# Altium schematic sheet Voltage Regulation.SchDoc
size A4; SheetNumber: 2; SheetTotal: 2
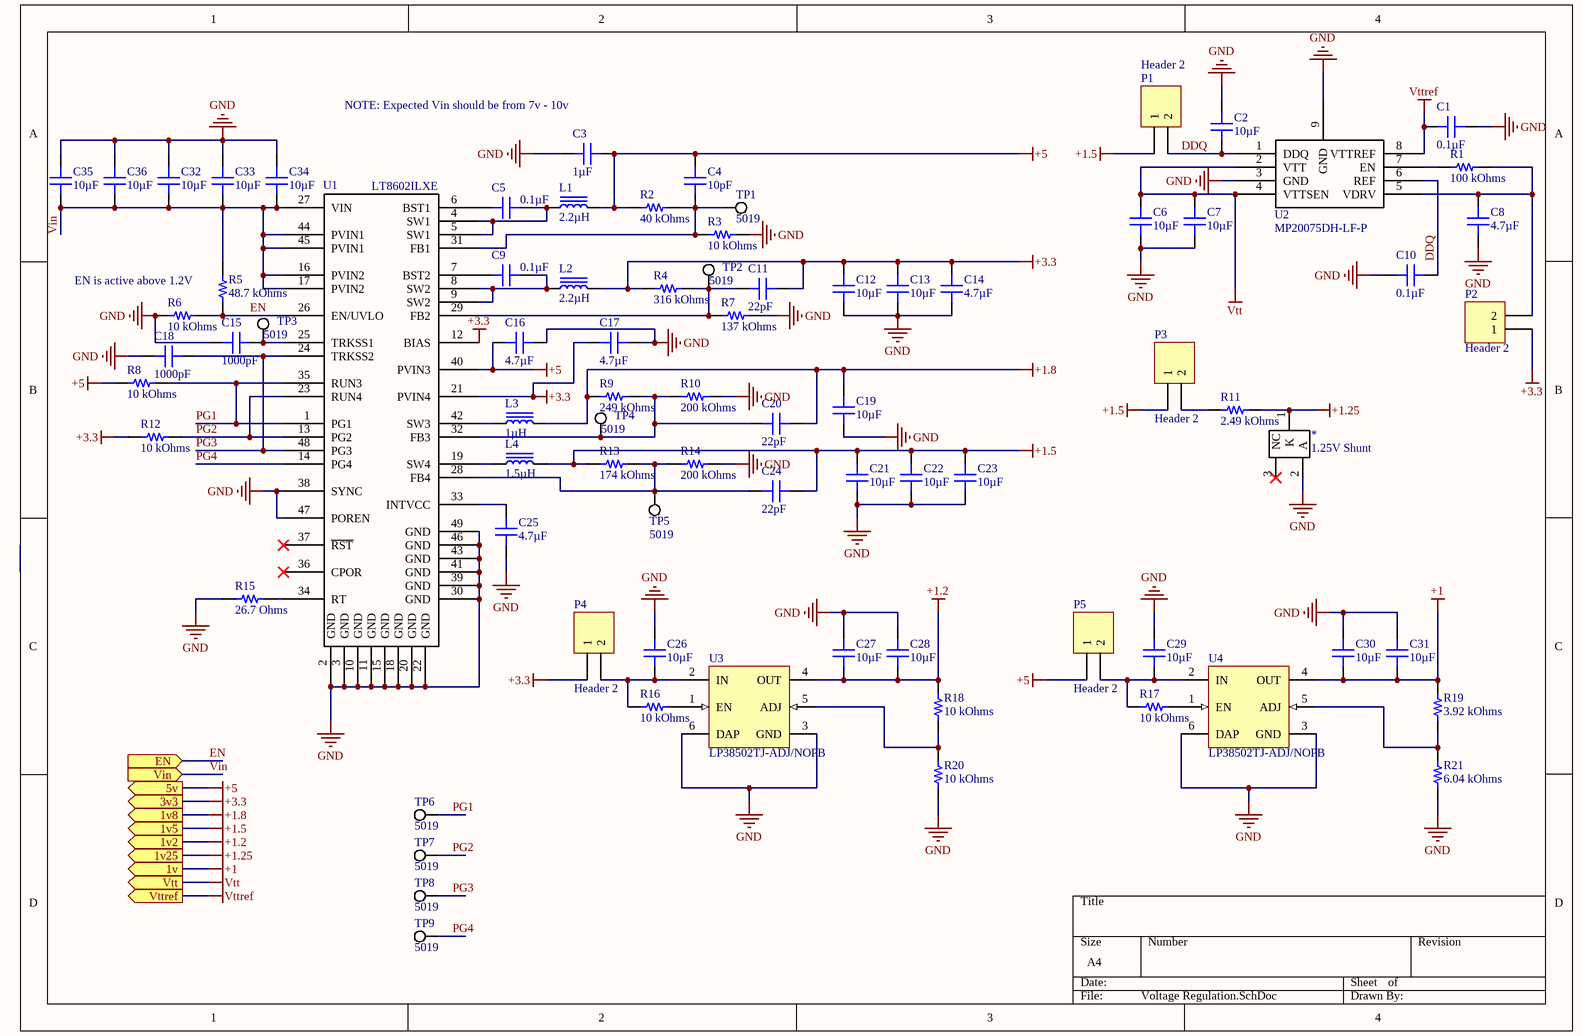
[diagram p0: Voltage Regulation.SchDoc]

## Parts
*  1.25V Shunt  [TS4061AILT-1.25]
C1  0.1µF  [CAP 0805_2012]
C2  10µF  [CAP 0805_2012]
C3  1µF  [CAP 0805_2012]
C4  10pF  [CAP 0805_2012]
C5  0.1µF  [CAP 0805_2012]
C6  10µF  [CAP 0805_2012]
C7  10µF  [CAP 0805_2012]
C8  4.7µF  [CAP 0805_2012]
C9  0.1µF  [CAP 0805_2012]
C10  0.1µF  [CAP 0805_2012]
C11  22pF  [CAP 0805_2012]
C12  10µF  [CAP 0805_2012]
C13  10µF  [CAP 0805_2012]
C14  4.7µF  [CAP 0805_2012]
C15  1000pF  [CAP 0805_2012]
C16  4.7µF  [CAP 0805_2012]
C17  4.7µF  [CAP 0805_2012]
C18  1000pF  [CAP 0805_2012]
C19  10µF  [CAP 0805_2012]
C20  22pF  [CAP 0805_2012]
C21  10µF  [CAP 0805_2012]
C22  10µF  [CAP 0805_2012]
C23  10µF  [CAP 0805_2012]
C24  22pF  [CAP 0805_2012]
C25  4.7µF  [CAP 0805_2012]
C26  10µF  [CAP 0805_2012]
C27  10µF  [CAP 0805_2012]
C28  10µF  [CAP 0805_2012]
C29  10µF  [CAP 0805_2012]
C30  10µF  [CAP 0805_2012]
C31  10µF  [CAP 0805_2012]
C32  10µF  [CAP 0805_2012]
C33  10µF  [CAP 0805_2012]
C34  10µF  [CAP 0805_2012]
C35  10µF  [CAP 0805_2012]
C36  10µF  [CAP 0805_2012]
L1  2.2µH  [WURTH WE-LQS 6045]
L2  2.2µH  [WURTH WE-LQS 6045]
L3  1µH  [IND 0806_2016]
L4  1.5µH  [TDK VLS252012HBX-1]
P1  Header 2  [HDR1X2]
P2  Header 2  [HDR1X2]
P3  Header 2  [HDR1X2]
P4  Header 2  [HDR1X2]
P5  Header 2  [HDR1X2]
R1  100 kOhms  [RES 0805_2012]
R2  40 kOhms  [RES 0805_2012]
R3  10 kOhms  [RES 0805_2012]
R4  316 kOhms  [RES 0805_2012]
R5  48.7 kOhms  [RES 0805_2012]
R6  10 kOhms  [RES 0805_2012]
R7  137 kOhms  [RES 0805_2012]
R8  10 kOhms  [RES 0805_2012]
R9  249 kOhms  [RES 0805_2012]
R10  200 kOhms  [RES 0805_2012]
R11  2.49 kOhms  [RES 0805_2012]
R12  10 kOhms  [RES 0805_2012]
R13  174 kOhms  [RES 0805_2012]
R14  200 kOhms  [RES 0805_2012]
R15  26.7 Ohms  [RES 0805_2012]
R16  10 kOhms  [RES 0805_2012]
R17  10 kOhms  [RES 0805_2012]
R18  10 kOhms  [RES 0805_2012]
R19  3.92 kOhms  [RES 0805_2012]
R20  10 kOhms  [RES 0805_2012]
R21  6.04 kOhms  [RES 0805_2012]
TP1  5019  [KSTN-5019_V]
TP2  5019  [KSTN-5019_V]
TP3  5019  [KSTN-5019_V]
TP4  5019  [KSTN-5019_V]
TP5  5019  [KSTN-5019_V]
TP6  5019  [KSTN-5019_V]
TP7  5019  [KSTN-5019_V]
TP8  5019  [KSTN-5019_V]
TP9  5019  [KSTN-5019_V]
U1  LT8602ILXE  [Quad48]
U2  MP20075DH-LF-P  [MP20075]
U3  LP38502TJ-ADJ/NOPB  [NDQ0005A_L]
U4  LP38502TJ-ADJ/NOPB  [NDQ0005A_L]

## Ports
1v2 (out), 1v5 (out), 1v8 (out), 1v25 (out), 1v (out), 3v3 (out), 5v (out), EN (in), Vin (in), Vtt (out), Vttref (out)

## Nets
+1: C30.1 C31.1 R19.2 U4.4(OUT) ; port 1v
+1.2: C27.1 C28.1 R18.2 U3.4(OUT) ; port 1v2
+1.5: C21.2 C22.2 C23.2 C24.2 L4.2 P1.1 P3.1 R13.1 ; port 1v5
+1.8: C19.2 C20.2 L3.2 R9.1 ; port 1v8
+1.25: *.1(K) R11.2 ; port 1v25
+3.3: C11.2 C12.2 C13.2 C14.2 C17.2 L2.2 P2.1 P4.1 R4.1 R12.1 U1.12(BIAS) U1.21(PVIN4) ; port 3v3
+5: C3.2 C4.2 C16.2 L1.2 P5.1 R2.1 R8.1 U1.40(PVIN3) ; port 5v
GND: *.2(A) C1.2 C2.2 C3.1 C6.1 C7.1 C8.1 C10.1 C12.1 C13.1 C14.1 C15.1 C16.1 C17.1 C18.1 C19.1 C21.1 C22.1 C23.1 C25.1 C26.2 C27.2 C28.2 C29.2 C30.2 C31.2 C32.2 C33.2 C34.2 C35.2 C36.2 R3.2 R6.1 R7.2 R10.2 R14.2 R15.1 R20.1 R21.1 U1.2(GND) U1.3(GND) U1.10(GND) U1.11(GND) U1.15(GND) U1.18(GND) U1.20(GND) U1.22(GND) U1.30(GND) U1.38(SYNC) U1.39(GND) U1.41(GND) U1.43(GND) U1.46(GND) U1.47(POREN) U1.49(GND) U2.3(GND) U2.9(GND) U3.3(GND) U3.6(DAP) U4.3(GND) U4.6(DAP)
Vtt: C6.2 C7.2 U2.2(VTT) U2.4(VTTSEN) ; port Vtt
Vttref: C1.1 U2.8(VTTREF) ; port Vttref
DDQ: C2.1 C10.2 P1.2 U2.1(DDQ) U2.6(REF)
EN: R5.1 R6.2 U1.26(EN/UVLO) ; port EN
PG1: R8.2 TP6.1 U1.1(PG1) U1.35(RUN3)
PG2: R12.2 TP7.1 U1.13(PG2) U1.23(RUN4)
PG3: C18.2 TP8.1 U1.24(TRKSS2) U1.48(PG3)
PG4: TP9.1 U1.14(PG4)
Vin: C32.1 C33.1 C34.1 C35.1 C36.1 R5.2 U1.16(PVIN2) U1.17(PVIN2) U1.27(VIN) U1.44(PVIN1) U1.45(PVIN1) ; port Vin
NetC4_1: C4.1 R2.2 R3.1 TP1.1 U1.31(FB1)
NetC5_1: C5.1 U1.6(BST1)
NetC5_2: C5.2 L1.1 U1.4(SW1) U1.5(SW1)
NetC8_2: C8.2 P2.2 R1.1 U2.5(VDRV)
NetC9_1: C9.1 U1.7(BST2)
NetC9_2: C9.2 L2.1 U1.8(SW2) U1.9(SW2)
NetC11_1: C11.1 R4.2 R7.1 TP2.1 U1.29(FB2)
NetC15_2: C15.2 TP3.1 U1.25(TRKSS1)
NetC20_1: C20.1 R9.2 R10.1 TP4.1 U1.32(FB3)
NetC24_1: C24.1 R13.2 R14.1 TP5.1 U1.28(FB4)
NetC25_2: C25.2 U1.33(INTVCC)
NetC26_1: C26.1 P4.2 R16.1 U3.2(IN)
NetC29_1: C29.1 P5.2 R17.1 U4.2(IN)
NetL3_1: L3.1 U1.42(SW3)
NetL4_1: L4.1 U1.19(SW4)
NetP3_2: P3.2 R11.1
NetR1_2: R1.2 U2.7(EN)
NetR15_2: R15.2 U1.34(RT)
NetR16_2: R16.2 U3.1(EN)
NetR17_2: R17.2 U4.1(EN)
NetR18_1: R18.1 R20.2 U3.5(ADJ)
NetR19_1: R19.1 R21.2 U4.5(ADJ)

Not connected (* = marked no-connect by the designer): * 3(NC)*; U1 36(CPOR)* 37(~{RST})*

## Notes on the sheet
- (near C3) NOTE: Expected Vin should be from 7v - 10v
- (near R5) EN is active above 1.2V

## Library data of the parts
C1 C10 = 08055C104KAT4A: CAP CER 0.1UF 50V X7R 0805; Manufacturer: AVX Corporation; Tolerance: ±10%; Part Number: 08055C104KAT4A; Value: 0.1µF; Applications: General Purpose; Capacitance: 0.1µF; ComponentLink1Description: Datasheet; ComponentLink1URL: http://datasheets.avx.com/X7RDielectric.pdf; ComponentLink2Description: DigiKey Link; ComponentLink2URL: http://digikey.com/product-detail/en/avx-corporation/08055C104KAT4A/478-10836-1-ND/7536355; Device Package: 0805 (2012 Metric); LastUpdated: 2020-09-02 1:04:35 AM; Lifecycle Status: Active; Minimum Order: 1; Mounting Type: Surface Mount, MLCC; Operating Temperature: -55°C ~ 125°C; Package / Case: 0805 (2012 Metric); Packaging: TapeAndReel; PartId: 6258; Part Status: Active; Price: 0.01; Series: -; Size / Dimension: 0.079" L x 0.049" W (2.01mm x 1.25mm); Supplier 1: DigiKey; Supplier Part Number 1: 478-10836-1-ND; Temperature Coefficient: X7R; Thickness (Max): 0.037" (0.94mm); Voltage - Rated: 50V
C2 C6 C7 C12 C13 C19 C21-C23 C26-C36 = CL21B106KQQNFNE: CAP CER 10UF 6.3V X7R 0805; Manufacturer: Samsung Electro-Mechanics; Tolerance: ±10%; Part Number: CL21B106KQQNFNE; Value: 10µF; Applications: General Purpose; Capacitance: 10µF; ComponentLink1Description: Datasheet; ComponentLink1URL: http://www.samsungsem.com/kr/support/product-search/mlcc/CL21B106KQQNFNE.jsp; ComponentLink2Description: DigiKey Link; ComponentLink2URL: http://digikey.com/product-detail/en/samsung-electro-mechanics/CL21B106KQQNFNE/1276-2935-1-ND/3891021; Device Package: 0805 (2012 Metric); LastUpdated: 2020-09-02 1:04:08 AM; Lifecycle Status: Active; Minimum Order: 1; Mounting Type: Surface Mount, MLCC; Operating Temperature: -55°C ~ 125°C; Package / Case: 0805 (2012 Metric); Packaging: TapeAndReel; PartId: 17977; Part Status: Active; Price: 0.05; Series: CL; Size / Dimension: 0.079" L x 0.049" W (2.00mm x 1.25mm); Supplier 1: DigiKey; Supplier Part Number 1: 1276-2935-1-ND; Temperature Coefficient: X7R; Thickness (Max): 0.055" (1.40mm); Voltage - Rated: 6.3V
C3 = 885012207078: CAP CER 1UF 25V X7R 0805; Manufacturer: Würth Elektronik; Tolerance: ±10%; Part Number: 885012207078; Value: 1µF; Applications: General Purpose; Capacitance: 1µF; ComponentLink1Description: Datasheet; ComponentLink1URL: https://katalog.we-online.de/pbs/datasheet/885012207078.pdf; ComponentLink2Description: DigiKey Link; ComponentLink2URL: http://digikey.com/product-detail/en/w-rth-elektronik/885012207078/732-7672-1-ND/5454299; Device Package: 0805 (2012 Metric); LastUpdated: 2020-09-02 1:04:13 AM; Lifecycle Status: Active; Minimum Order: 1; Mounting Type: Surface Mount, MLCC; Operating Temperature: -55°C ~ 125°C; Package / Case: 0805 (2012 Metric); Packaging: TapeAndReel; PartId: 16212; Part Status: Active; Price: 0.06; Series: WCAP-CSGP; Size / Dimension: 0.079" L x 0.049" W (2.00mm x 1.25mm); Supplier 1: DigiKey; Supplier Part Number 1: 732-7672-1-ND; Temperature Coefficient: X7R; Thickness (Max): 0.053" (1.35mm); Voltage - Rated: 25V
C4 = C0805C100K5GACTU: CAP CER 10PF 50V C0G/NP0 0805; Manufacturer: KEMET; Temperature Coefficient: C0G, NP0; Tolerance: ±10%; Part Number: C0805C100K5GACTU; Value: 10pF; Applications: General Purpose; Capacitance: 10pF; ComponentLink1Description: Datasheet; ComponentLink1URL: https://api.kemet.com/component-edge/download/datasheet/C0805C100K5GACTU.pdf; ComponentLink2Description: DigiKey Link; ComponentLink2URL: http://digikey.com/product-detail/en/kemet/C0805C100K5GACTU/399-7975-1-ND/3471698; Device Package: 0805 (2012 Metric); Features: Low ESL; LastUpdated: 2020-09-02 1:04:20 AM; Lifecycle Status: Active; Minimum Order: 1; Mounting Type: Surface Mount, MLCC; Operating Temperature: -55°C ~ 125°C; Package / Case: 0805 (2012 Metric); Packaging: TapeAndReel; PartId: 14017; Part Status: Active; Price: 0.01; Series: SMD Comm C0G; Size / Dimension: 0.079" L x 0.049" W (2.00mm x 1.25mm); Supplier 1: DigiKey; Supplier Part Number 1: 399-7975-1-ND; Thickness (Max): 0.035" (0.88mm); Voltage - Rated: 50V
C5 C9 = C0805C104M5RACTU: CAP CER 0.1UF 50V X7R 0805; Manufacturer: KEMET; Tolerance: ±20%; Part Number: C0805C104M5RACTU; Value: 0.1µF; Applications: Bypass, Decoupling; Capacitance: 0.1µF; ComponentLink1Description: Datasheet; ComponentLink1URL: https://api.kemet.com/component-edge/download/datasheet/C0805C104M5RACTU.pdf; ComponentLink2Description: DigiKey Link; ComponentLink2URL: http://digikey.com/product-detail/en/kemet/C0805C104M5RACTU/399-1169-1-ND/411444; Device Package: 0805 (2012 Metric); LastUpdated: 2020-09-02 1:04:36 AM; Lifecycle Status: Active; Minimum Order: 1; Mounting Type: Surface Mount, MLCC; Operating Temperature: -55°C ~ 125°C; Package / Case: 0805 (2012 Metric); Packaging: TapeAndReel; PartId: 5793; Part Status: Active; Price: 0.01; Series: SMD Comm X7R; Size / Dimension: 0.079" L x 0.049" W (2.00mm x 1.25mm); Supplier 1: DigiKey; Supplier Part Number 1: 399-1169-1-ND; Temperature Coefficient: X7R; Thickness (Max): 0.035" (0.88mm); Voltage - Rated: 50V
C8 C14 C16 C17 C25 = GRM21BR71C475KE51L: CAP CER 4.7UF 16V X7R 0805; Manufacturer: Murata Electronics; Tolerance: ±10%; Part Number: GRM21BR71C475KE51L; Value: 4.7µF; Applications: General Purpose; Capacitance: 4.7µF; ComponentLink1Description: Datasheet; ComponentLink1URL: https://search.murata.co.jp/Ceramy/image/img/A01X/G101/ENG/GRM21BR71C475KE51-01.pdf; ComponentLink2Description: DigiKey Link; ComponentLink2URL: http://digikey.com/product-detail/en/murata-electronics/GRM21BR71C475KE51L/490-14466-1-ND/6606927; Device Package: 0805 (2012 Metric); LastUpdated: 2020-09-02 1:04:31 AM; Lifecycle Status: Active; Minimum Order: 1; Mounting Type: Surface Mount, MLCC; Operating Temperature: -55°C ~ 125°C; Package / Case: 0805 (2012 Metric); Packaging: TapeAndReel; PartId: 8696; Part Status: Active; Price: 0.04; Series: GRM; Size / Dimension: 0.079" L x 0.049" W (2.00mm x 1.25mm); Supplier 1: DigiKey; Supplier Part Number 1: 490-14466-1-ND; Temperature Coefficient: X7R; Thickness (Max): 0.055" (1.40mm); Voltage - Rated: 16V
C11 C20 C24 = C0805C220J5RAC7800: CAP CER SMD 0805 22PF 5% 50V X7R; Manufacturer: KEMET; Part Number: C0805C220J5RAC7800; Value: 22pF; Applications: Bypass, Decoupling; Capacitance: 22pF; ComponentLink1Description: Datasheet; ComponentLink1URL: https://api.kemet.com/component-edge/download/datasheet/C0805C220J5RAC7800.pdf; ComponentLink2Description: DigiKey Link; ComponentLink2URL: http://digikey.com/product-detail/en/kemet/C0805C220J5RAC7800/399-17625-1-ND/8572625; Device Package: 0805 (2012 Metric); LastUpdated: 2020-09-02 1:04:09 AM; Lifecycle Status: Active; Minimum Order: 1; Mounting Type: Surface Mount, MLCC; Operating Temperature: -55°C ~ 125°C; Package / Case: 0805 (2012 Metric); Packaging: TapeAndReel; PartId: 17442; Part Status: Active; Price: 0.03; Series: SMD Comm X7R; Size / Dimension: 0.079" L x 0.049" W (2.00mm x 1.25mm); Supplier 1: DigiKey; Supplier Part Number 1: 399-17625-1-ND; Temperature Coefficient: X7R; Thickness (Max): 0.035" (0.88mm); Tolerance: ±5%; Voltage - Rated: 50V
C15 C18 = 885012207033: CAP CER 1000PF 16V X7R 0805; Manufacturer: Würth Elektronik; Tolerance: ±10%; Part Number: 885012207033; Value: 1000pF; Applications: General Purpose; Capacitance: 1000pF; ComponentLink1Description: Datasheet; ComponentLink1URL: https://katalog.we-online.de/pbs/datasheet/885012207033.pdf; ComponentLink2Description: DigiKey Link; ComponentLink2URL: http://digikey.com/product-detail/en/w-rth-elektronik/885012207033/732-8033-1-ND/5454660; Device Package: 0805 (2012 Metric); LastUpdated: 2020-09-02 1:04:24 AM; Lifecycle Status: Active; Minimum Order: 1; Mounting Type: Surface Mount, MLCC; Operating Temperature: -55°C ~ 125°C; Package / Case: 0805 (2012 Metric); Packaging: TapeAndReel; PartId: 12259; Part Status: Active; Price: 0.03; Series: WCAP-CSGP; Size / Dimension: 0.079" L x 0.049" W (2.00mm x 1.25mm); Supplier 1: DigiKey; Supplier Part Number 1: 732-8033-1-ND; Temperature Coefficient: X7R; Thickness (Max): 0.035" (0.90mm); Voltage - Rated: 16V
L1 L2 = 74404064022: FIXED IND 2.2UH 4.6A 14 MOHM SMD; Manufacturer: Würth Elektronik; Current - Saturation: 7.4A; DC Resistance (DCR): 14mOhm; Frequency - Self Resonant: 60MHz; Inductance Frequency - Test: 100kHz; Material - Core: Ferrite; Shielding: Shielded; Tolerance: ±30%; Type: Wirewound; Part Number: 74404064022; ComponentLink1Description: Datasheet; ComponentLink1URL: https://katalog.we-online.de/pbs/datasheet/74404064022.pdf; ComponentLink2Description: DigiKey Link; ComponentLink2URL: http://digikey.com/product-detail/en/w-rth-elektronik/74404064022/732-5544-1-ND/4865437; Current Rating (Amps): 4.6A; Device Package: Nonstandard; Height - Seated (Max): 0.177" (4.50mm); Inductance: 2.2µH; LastUpdated: 2020-08-13 11:04:46 AM; Lifecycle Status: Active; Minimum Order: 1; Mounting Type: Surface Mount; Operating Temperature: -40°C ~ 125°C; Package / Case: Nonstandard; Packaging: TapeAndReel; PartId: 3699; Part Status: Active; Price: 0.69; Series: WE-LQS; Size / Dimension: 0.236" L x 0.236" W (6.00mm x 6.00mm); Supplier 1: DigiKey; Supplier Part Number 1: 732-5544-1-ND; Supplier Device Package: 6045; Value: 2.2µH
L3 = VLS201612HBX-1R0M-1: FIXED IND 1UH 2.7A 72 MOHM SMD; Manufacturer: TDK Corporation; Current - Saturation: 2.42A; DC Resistance (DCR): 72mOhm Max; Inductance Frequency - Test: 1MHz; Material - Core: Metal; Shielding: Shielded; Tolerance: ±20%; Type: Wirewound; Part Number: VLS201612HBX-1R0M-1; ComponentLink1Description: Datasheet; ComponentLink1URL: https://product.tdk.com/info/en/catalog/datasheets/inductor_commercial_power_vls201612hbx-1_en.pdf?ref_disty=digikey; ComponentLink2Description: DigiKey Link; ComponentLink2URL: http://digikey.com/product-detail/en/tdk-corporation/VLS201612HBX-1R0M-1/445-173010-1-ND/5250929; Current Rating (Amps): 2.7A; Device Package: 0806 (2016 Metric); Height - Seated (Max): 0.047" (1.20mm); Inductance: 1µH; LastUpdated: 2020-09-02 1:24:35 AM; Lifecycle Status: Active; Minimum Order: 1; Mounting Type: Surface Mount; Operating Temperature: -40°C ~ 105°C; Package / Case: 0806 (2016 Metric); Packaging: TapeAndReel; PartId: 225; Part Status: Active; Price: 0.13; Series: VLS-HBX-1; Size / Dimension: 0.079" L x 0.063" W (2.00mm x 1.60mm); Supplier 1: DigiKey; Supplier Part Number 1: 445-173010-1-ND; Supplier Device Package: 0806 (2016 Metric); Value: 1µH
L4 = VLS252012HBX-1R5M-1: FIXED IND 1.5UH 2.75A 82 MOHM; Manufacturer: TDK Corporation; Current - Saturation: 2.5A; DC Resistance (DCR): 82mOhm Max; Inductance Frequency - Test: 1MHz; Material - Core: Metal; Shielding: Shielded; Tolerance: ±20%; Type: Wirewound; Part Number: VLS252012HBX-1R5M-1; ComponentLink1Description: Datasheet; ComponentLink1URL: https://product.tdk.com/info/en/catalog/datasheets/inductor_commercial_power_vls252012hbx-1_en.pdf?ref_disty=digikey; ComponentLink2Description: DigiKey Link; ComponentLink2URL: http://digikey.com/product-detail/en/tdk-corporation/VLS252012HBX-1R5M-1/445-173026-1-ND/5250945; Current Rating (Amps): 2.75A; Device Package: 1008 (2520 Metric); Height - Seated (Max): 0.047" (1.20mm); Inductance: 1.5µH; LastUpdated: 2020-09-02 1:22:18 AM; Lifecycle Status: Active; Minimum Order: 1; Mounting Type: Surface Mount; Operating Temperature: -40°C ~ 105°C; Package / Case: 1008 (2520 Metric); Packaging: TapeAndReel; PartId: 239; Part Status: Active; Price: 0.14; Series: VLS-HBX-1; Size / Dimension: 0.098" L x 0.079" W (2.50mm x 2.00mm); Supplier 1: DigiKey; Supplier Part Number 1: 445-173026-1-ND; Supplier Device Package: 1008 (2520 Metric); Value: 1.5µH
P1-P5 = Header 2: Header, 2-Pin; LatestRevisionDate: 17-Jul-2002; LatestRevisionNote: Re-released for DXP Platform.; Publisher: Altium Limited
R1 = CR0805-FX-1003ELF: RES SMD 100K OHM 1% 1/8W 0805; Manufacturer: Bourns Inc.; Power (Watts): 0.125W, 1/8W; Temperature Coefficient: ±100ppm/°C; Part Number: CR0805-FX-1003ELF; Value: 100 kOhms; ComponentLink1Description: Datasheet; ComponentLink1URL: https://www.bourns.com/docs/Product-Datasheets/CHPREZTR.pdf; ComponentLink2Description: DigiKey Link; ComponentLink2URL: http://digikey.com/product-detail/en/bourns-inc/CR0805-FX-1003ELF/CR0805-FX-1003ELFCT-ND/3740923; Composition: Thick Film; Device Package: 0805 (2012 Metric); Features: Moisture Resistant; Height - Seated (Max): 0.024" (0.60mm); LastUpdated: 2020-09-02 1:14:46 AM; Lifecycle Status: Active; Minimum Order: 1; Number of Terminations: 2; Operating Temperature: -55°C ~ 155°C; Package / Case: 0805 (2012 Metric); Packaging: CutTape; PartId: 44720; Part Status: Active; Price: 0.10; Resistance: 100 kOhms; Series: CR0805; Size / Dimension: 0.079" L x 0.049" W (2.00mm x 1.25mm); Supplier 1: DigiKey; Supplier Part Number 1: CR0805-FX-1003ELFCT-ND; Supplier Device Package: 0805; Tolerance: ±1%
R2 = CRCW080540K0FKEA: RES SMD 40K OHM 1% 1/8W 0805; Manufacturer: Vishay Dale; Power (Watts): 0.125W, 1/8W; Temperature Coefficient: ±100ppm/°C; Part Number: CRCW080540K0FKEA; Value: 40 kOhms; ComponentLink1Description: Datasheet; ComponentLink1URL: http://www.vishay.com/docs/20035/dcrcwe3.pdf; ComponentLink2Description: DigiKey Link; ComponentLink2URL: http://digikey.com/product-detail/en/vishay-dale/CRCW080540K0FKEA/541-CRCW080540K0FKEACT-ND/11501179; Composition: Thick Film; Device Package: 0805 (2012 Metric); Features: Automotive AEC-Q200; LastUpdated: 2020-09-02 1:14:22 AM; Lifecycle Status: Active; Minimum Order: 1; Number of Terminations: 2; Operating Temperature: -55°C ~ 155°C; Package / Case: 0805 (2012 Metric); Packaging: TapeAndReel; PartId: 57108; Price: 0.01; Ratings: AEC-Q200; Resistance: 40 kOhms; Series: CRCW; Supplier 1: DigiKey; Supplier Part Number 1: 541-CRCW080540K0FKEACT-ND; Supplier Device Package: 0805; Tolerance: ±1%
R3 R6 R8 R12 R16-R18 R20 = RMCF0805FT10K0: RES 10K OHM 1% 1/8W 0805; Manufacturer: Stackpole Electronics Inc; Power (Watts): 0.125W, 1/8W; Temperature Coefficient: ±100ppm/°C; Part Number: RMCF0805FT10K0; Value: 10 kOhms; ComponentLink1Description: Datasheet; ComponentLink1URL: https://www.seielect.com/catalog/sei-rmcf_rmcp.pdf; ComponentLink2Description: DigiKey Link; ComponentLink2URL: http://digikey.com/product-detail/en/stackpole-electronics-inc/RMCF0805FT10K0/RMCF0805FT10K0CT-ND/1942435; Composition: Thick Film; Device Package: 0805 (2012 Metric); Features: Automotive AEC-Q200; Height - Seated (Max): 0.026" (0.65mm); LastUpdated: 2020-09-02 1:14:38 AM; Lifecycle Status: Active; Minimum Order: 1; Number of Terminations: 2; Operating Temperature: -55°C ~ 155°C; Package / Case: 0805 (2012 Metric); Packaging: CutTape; PartId: 47306; Part Status: Active; Price: 0.10; Ratings: AEC-Q200; Resistance: 10 kOhms; Series: RMCF; Size / Dimension: 0.079" L x 0.049" W (2.00mm x 1.25mm); Supplier 1: DigiKey; Supplier Part Number 1: RMCF0805FT10K0CT-ND; Supplier Device Package: 0805; Tolerance: ±1%
R4 = ERJ-6ENF3163V: RES SMD 316K OHM 1% 1/8W 0805; Manufacturer: Panasonic Electronic Components; Power (Watts): 0.125W, 1/8W; Temperature Coefficient: ±100ppm/°C; Part Number: ERJ-6ENF3163V; Value: 316 kOhms; ComponentLink1Description: Datasheet; ComponentLink1URL: https://industrial.panasonic.com/cdbs/www-data/pdf/RDA0000/AOA0000C304.pdf; ComponentLink2Description: DigiKey Link; ComponentLink2URL: http://digikey.com/product-detail/en/panasonic-electronic-components/ERJ-6ENF3163V/P316KCCT-ND/119694; Composition: Thick Film; Device Package: 0805 (2012 Metric); Features: Automotive AEC-Q200; Height - Seated (Max): 0.028" (0.70mm); LastUpdated: 2020-09-02 1:14:42 AM; Lifecycle Status: Active; Minimum Order: 1; Number of Terminations: 2; Operating Temperature: -55°C ~ 155°C; Package / Case: 0805 (2012 Metric); Packaging: TapeAndReel; PartId: 46313; Part Status: Active; Price: 0.01; Ratings: AEC-Q200; Resistance: 316 kOhms; Series: ERJ; Size / Dimension: 0.079" L x 0.049" W (2.00mm x 1.25mm); Supplier 1: DigiKey; Supplier Part Number 1: P316KCCT-ND; Supplier Device Package: 0805; Tolerance: ±1%
R5 = RC0805FR-0748K7L: RES SMD 48.7K OHM 1% 1/8W 0805; Manufacturer: Yageo; Power (Watts): 0.125W, 1/8W; Temperature Coefficient: ±100ppm/°C; Part Number: RC0805FR-0748K7L; Value: 48.7 kOhms; ComponentLink1Description: Datasheet; ComponentLink1URL: https://www.yageo.com/upload/media/product/productsearch/datasheet/rchip/PYu-RC_Group_51_RoHS_L_10.pdf; ComponentLink2Description: DigiKey Link; ComponentLink2URL: http://digikey.com/product-detail/en/yageo/RC0805FR-0748K7L/311-48.7KCRCT-ND/730928; Composition: Thick Film; Device Package: 0805 (2012 Metric); Features: Moisture Resistant; Height - Seated (Max): 0.024" (0.60mm); LastUpdated: 2020-09-02 1:15:04 AM; Lifecycle Status: Active; Minimum Order: 1; Number of Terminations: 2; Operating Temperature: -55°C ~ 155°C; Package / Case: 0805 (2012 Metric); Packaging: CutTape; PartId: 36985; Part Status: Active; Price: 0.10; Resistance: 48.7 kOhms; Series: RC; Size / Dimension: 0.079" L x 0.049" W (2.00mm x 1.25mm); Supplier 1: DigiKey; Supplier Part Number 1: 311-48.7KCRCT-ND; Supplier Device Package: 0805; Tolerance: ±1%
R7 = RC0805FR-07137KL: RES SMD 137K OHM 1% 1/8W 0805; Manufacturer: Yageo; Power (Watts): 0.125W, 1/8W; Temperature Coefficient: ±100ppm/°C; Part Number: RC0805FR-07137KL; Value: 137 kOhms; ComponentLink1Description: Datasheet; ComponentLink1URL: https://www.yageo.com/upload/media/product/productsearch/datasheet/rchip/PYu-RC_Group_51_RoHS_L_10.pdf; ComponentLink2Description: DigiKey Link; ComponentLink2URL: http://digikey.com/product-detail/en/yageo/RC0805FR-07137KL/311-137KCRCT-ND/730541; Composition: Thick Film; Device Package: 0805 (2012 Metric); Features: Moisture Resistant; Height - Seated (Max): 0.024" (0.60mm); LastUpdated: 2020-09-02 1:15:04 AM; Lifecycle Status: Active; Minimum Order: 1; Number of Terminations: 2; Operating Temperature: -55°C ~ 155°C; Package / Case: 0805 (2012 Metric); Packaging: CutTape; PartId: 36908; Part Status: Active; Price: 0.10; Resistance: 137 kOhms; Series: RC; Size / Dimension: 0.079" L x 0.049" W (2.00mm x 1.25mm); Supplier 1: DigiKey; Supplier Part Number 1: 311-137KCRCT-ND; Supplier Device Package: 0805; Tolerance: ±1%
R9 = ERJ-6ENF2493V: RES SMD 249K OHM 1% 1/8W 0805; Manufacturer: Panasonic Electronic Components; Power (Watts): 0.125W, 1/8W; Temperature Coefficient: ±100ppm/°C; Part Number: ERJ-6ENF2493V; Value: 249 kOhms; ComponentLink1Description: Datasheet; ComponentLink1URL: https://industrial.panasonic.com/cdbs/www-data/pdf/RDA0000/AOA0000C304.pdf; ComponentLink2Description: DigiKey Link; ComponentLink2URL: http://digikey.com/product-detail/en/panasonic-electronic-components/ERJ-6ENF2493V/P249KCCT-ND/119664; Composition: Thick Film; Device Package: 0805 (2012 Metric); Features: Automotive AEC-Q200; Height - Seated (Max): 0.028" (0.70mm); LastUpdated: 2020-09-02 1:14:35 AM; Lifecycle Status: Active; Minimum Order: 1; Number of Terminations: 2; Operating Temperature: -55°C ~ 155°C; Package / Case: 0805 (2012 Metric); Packaging: TapeAndReel; PartId: 47910; Part Status: Active; Price: 0.01; Ratings: AEC-Q200; Resistance: 249 kOhms; Series: ERJ; Size / Dimension: 0.079" L x 0.049" W (2.00mm x 1.25mm); Supplier 1: DigiKey; Supplier Part Number 1: P249KCCT-ND; Supplier Device Package: 0805; Tolerance: ±1%
R10 R14 = AC0805FR-07200KL: RES SMD 200K OHM 1% 1/8W 0805; Manufacturer: Yageo; Power (Watts): 0.125W, 1/8W; Temperature Coefficient: ±100ppm/°C; Part Number: AC0805FR-07200KL; Value: 200 kOhms; ComponentLink1Description: Datasheet; ComponentLink1URL: https://www.yageo.com/upload/media/product/productsearch/datasheet/rchip/PYu-AC_51_RoHS_L_7.pdf; ComponentLink2Description: DigiKey Link; ComponentLink2URL: http://digikey.com/product-detail/en/yageo/AC0805FR-07200KL/YAG3706CT-ND/6006555; Composition: Thick Film; Device Package: 0805 (2012 Metric); Features: Automotive AEC-Q200, Moisture Resistant; Height - Seated (Max): 0.024" (0.60mm); LastUpdated: 2020-09-02 1:14:54 AM; Lifecycle Status: Active; Minimum Order: 1; Number of Terminations: 2; Operating Temperature: -55°C ~ 155°C; Package / Case: 0805 (2012 Metric); Packaging: TapeAndReel; PartId: 41383; Part Status: Active; Price: 0.01; Ratings: AEC-Q200; Resistance: 200 kOhms; Series: AC; Size / Dimension: 0.079" L x 0.049" W (2.00mm x 1.25mm); Supplier 1: DigiKey; Supplier Part Number 1: YAG3706CT-ND; Supplier Device Package: 0805; Tolerance: ±1%
R11 = RMCF0805FT2K49: RES 2.49K OHM 1% 1/8W 0805; Manufacturer: Stackpole Electronics Inc; Power (Watts): 0.125W, 1/8W; Temperature Coefficient: ±100ppm/°C; Part Number: RMCF0805FT2K49; Value: 2.49 kOhms; ComponentLink1Description: Datasheet; ComponentLink1URL: https://www.seielect.com/catalog/sei-rmcf_rmcp.pdf; ComponentLink2Description: DigiKey Link; ComponentLink2URL: http://digikey.com/product-detail/en/stackpole-electronics-inc/RMCF0805FT2K49/RMCF0805FT2K49CT-ND/1942392; Composition: Thick Film; Device Package: 0805 (2012 Metric); Features: Automotive AEC-Q200; Height - Seated (Max): 0.026" (0.65mm); LastUpdated: 2020-09-02 1:15:14 AM; Lifecycle Status: Active; Minimum Order: 1; Number of Terminations: 2; Operating Temperature: -55°C ~ 155°C; Package / Case: 0805 (2012 Metric); Packaging: CutTape; PartId: 32443; Part Status: Active; Price: 0.10; Ratings: AEC-Q200; Resistance: 2.49 kOhms; Series: RMCF; Size / Dimension: 0.079" L x 0.049" W (2.00mm x 1.25mm); Supplier 1: DigiKey; Supplier Part Number 1: RMCF0805FT2K49CT-ND; Supplier Device Package: 0805; Tolerance: ±1%
R13 = ERJ-6ENF1743V: RES SMD 174K OHM 1% 1/8W 0805; Manufacturer: Panasonic Electronic Components; Power (Watts): 0.125W, 1/8W; Temperature Coefficient: ±100ppm/°C; Part Number: ERJ-6ENF1743V; Value: 174 kOhms; ComponentLink1Description: Datasheet; ComponentLink1URL: https://industrial.panasonic.com/cdbs/www-data/pdf/RDA0000/AOA0000C304.pdf; ComponentLink2Description: DigiKey Link; ComponentLink2URL: http://digikey.com/product-detail/en/panasonic-electronic-components/ERJ-6ENF1743V/P174KCCT-ND/111154; Composition: Thick Film; Device Package: 0805 (2012 Metric); Features: Automotive AEC-Q200; Height - Seated (Max): 0.028" (0.70mm); LastUpdated: 2020-09-02 1:14:42 AM; Lifecycle Status: Active; Minimum Order: 1; Number of Terminations: 2; Operating Temperature: -55°C ~ 155°C; Package / Case: 0805 (2012 Metric); Packaging: TapeAndReel; PartId: 46286; Part Status: Active; Price: 0.01; Ratings: AEC-Q200; Resistance: 174 kOhms; Series: ERJ; Size / Dimension: 0.079" L x 0.049" W (2.00mm x 1.25mm); Supplier 1: DigiKey; Supplier Part Number 1: P174KCCT-ND; Supplier Device Package: 0805; Tolerance: ±1%
R15 = ERJ-6ENF26R7V: RES SMD 26.7 OHM 1% 1/8W 0805; Manufacturer: Panasonic Electronic Components; Power (Watts): 0.125W, 1/8W; Temperature Coefficient: ±100ppm/°C; Part Number: ERJ-6ENF26R7V; Value: 26.7 Ohms; ComponentLink1Description: Datasheet; ComponentLink1URL: https://industrial.panasonic.com/cdbs/www-data/pdf/RDA0000/AOA0000C304.pdf; ComponentLink2Description: DigiKey Link; ComponentLink2URL: http://digikey.com/product-detail/en/panasonic-electronic-components/ERJ-6ENF26R7V/P26.7CCT-ND/118502; Composition: Thick Film; Device Package: 0805 (2012 Metric); Features: Automotive AEC-Q200; Height - Seated (Max): 0.028" (0.70mm); LastUpdated: 2020-09-02 1:14:57 AM; Lifecycle Status: Active; Minimum Order: 1; Number of Terminations: 2; Operating Temperature: -55°C ~ 155°C; Package / Case: 0805 (2012 Metric); Packaging: TapeAndReel; PartId: 40270; Part Status: Active; Price: 0.01; Ratings: AEC-Q200; Resistance: 26.7 Ohms; Series: ERJ; Size / Dimension: 0.079" L x 0.049" W (2.00mm x 1.25mm); Supplier 1: DigiKey; Supplier Part Number 1: P26.7CCT-ND; Supplier Device Package: 0805; Tolerance: ±1%
R19 = ERJ-6ENF3921V: RES SMD 3.92K OHM 1% 1/8W 0805; Manufacturer: Panasonic Electronic Components; Power (Watts): 0.125W, 1/8W; Temperature Coefficient: ±100ppm/°C; Part Number: ERJ-6ENF3921V; Value: 3.92 kOhms; ComponentLink1Description: Datasheet; ComponentLink1URL: https://industrial.panasonic.com/cdbs/www-data/pdf/RDA0000/AOA0000C304.pdf; ComponentLink2Description: DigiKey Link; ComponentLink2URL: http://digikey.com/product-detail/en/panasonic-electronic-components/ERJ-6ENF3921V/P3.92KCCT-ND/119131; Composition: Thick Film; Device Package: 0805 (2012 Metric); Features: Automotive AEC-Q200; Height - Seated (Max): 0.028" (0.70mm); LastUpdated: 2020-09-02 1:15:19 AM; Lifecycle Status: Active; Minimum Order: 1; Number of Terminations: 2; Operating Temperature: -55°C ~ 155°C; Package / Case: 0805 (2012 Metric); Packaging: TapeAndReel; PartId: 30261; Part Status: Active; Price: 0.01; Ratings: AEC-Q200; Resistance: 3.92 kOhms; Series: ERJ; Size / Dimension: 0.079" L x 0.049" W (2.00mm x 1.25mm); Supplier 1: DigiKey; Supplier Part Number 1: P3.92KCCT-ND; Supplier Device Package: 0805; Tolerance: ±1%
R21 = ERJ-6ENF6041V: RES SMD 6.04K OHM 1% 1/8W 0805; Manufacturer: Panasonic Electronic Components; Power (Watts): 0.125W, 1/8W; Temperature Coefficient: ±100ppm/°C; Part Number: ERJ-6ENF6041V; Value: 6.04 kOhms; ComponentLink1Description: Datasheet; ComponentLink1URL: https://industrial.panasonic.com/cdbs/www-data/pdf/RDA0000/AOA0000C304.pdf; ComponentLink2Description: DigiKey Link; ComponentLink2URL: http://digikey.com/product-detail/en/panasonic-electronic-components/ERJ-6ENF6041V/P6.04KCCT-ND/119185; Composition: Thick Film; Device Package: 0805 (2012 Metric); Features: Automotive AEC-Q200; Height - Seated (Max): 0.028" (0.70mm); LastUpdated: 2020-09-02 1:15:19 AM; Lifecycle Status: Active; Minimum Order: 1; Number of Terminations: 2; Operating Temperature: -55°C ~ 155°C; Package / Case: 0805 (2012 Metric); Packaging: TapeAndReel; PartId: 30248; Part Status: Active; Price: 0.01; Ratings: AEC-Q200; Resistance: 6.04 kOhms; Series: ERJ; Size / Dimension: 0.079" L x 0.049" W (2.00mm x 1.25mm); Supplier 1: DigiKey; Supplier Part Number 1: P6.04KCCT-ND; Supplier Device Package: 0805; Tolerance: ±1%
TP1-TP9 = CMP-1672-00008-1: Test Point, 1 Position SMD, RoHS, Tape and Reel; ComponentLink1Description: Manufacturer URL; Package Quantity: 1000; DatasheetVersion: 03/2014; Packaging: Tape and Reel; ComponentLink2URL: http://www.keyelco.com/product-pdf.cfm?p=1357; ComponentLink1URL: http://www.keyelco.com/; Mount: Surface Mount; Contact Plating: Silver; PackageDescription: 1-Pin Surface Mount Device, Body 3.81 x 2.03 mm; Pins: 1; RoHSCompliant: True; Mounting Technology: Surface Mount; ComponentLink2Description: Datasheet; PackageReference: 5019
U1 = LT8602
U3 U4 = CMP-0062-00227-3: 1.5A FlexCap Low Dropout Linear Regulator for 2.7V to 5.5V Inputs, 5-pin TO-263 Thin, Pb-Free; Manufacturer: Texas Instruments; PowerWise: N; CompType: LDO IC; PackageTopMarking: NSUZXYTTE#*LP38502*TJ-ADJ; ComponentLink1URL: http://www.ti.com/general/docs/lit/getliterature.tsp?genericPartNumber=LP38502-ADJ&fileType=pdf; ComponentLink1Description: Datasheet URL; RoHS: Y; PinCount: 5; PackageDescription: Thin TO-263, Molded, 9.85 x 10.16 x 2mm Body, 5 Lead, 1.7mm Pitch, Surface Mount; PackageReference: NDQ0005A